# Altium schematic sheet MAZ000169 - Diagrama físico.SchDoc: MAZ000169 - Diagrama físico
size A; ApprovedBy: Christian Ledwidth; CheckedBy: Nahuel Martinez; Author: Santiago Marti; CompanyName: Body Health; DrawnBy: Santiago Marti; Revision: A; SheetNumber: 2; SheetTotal: 2
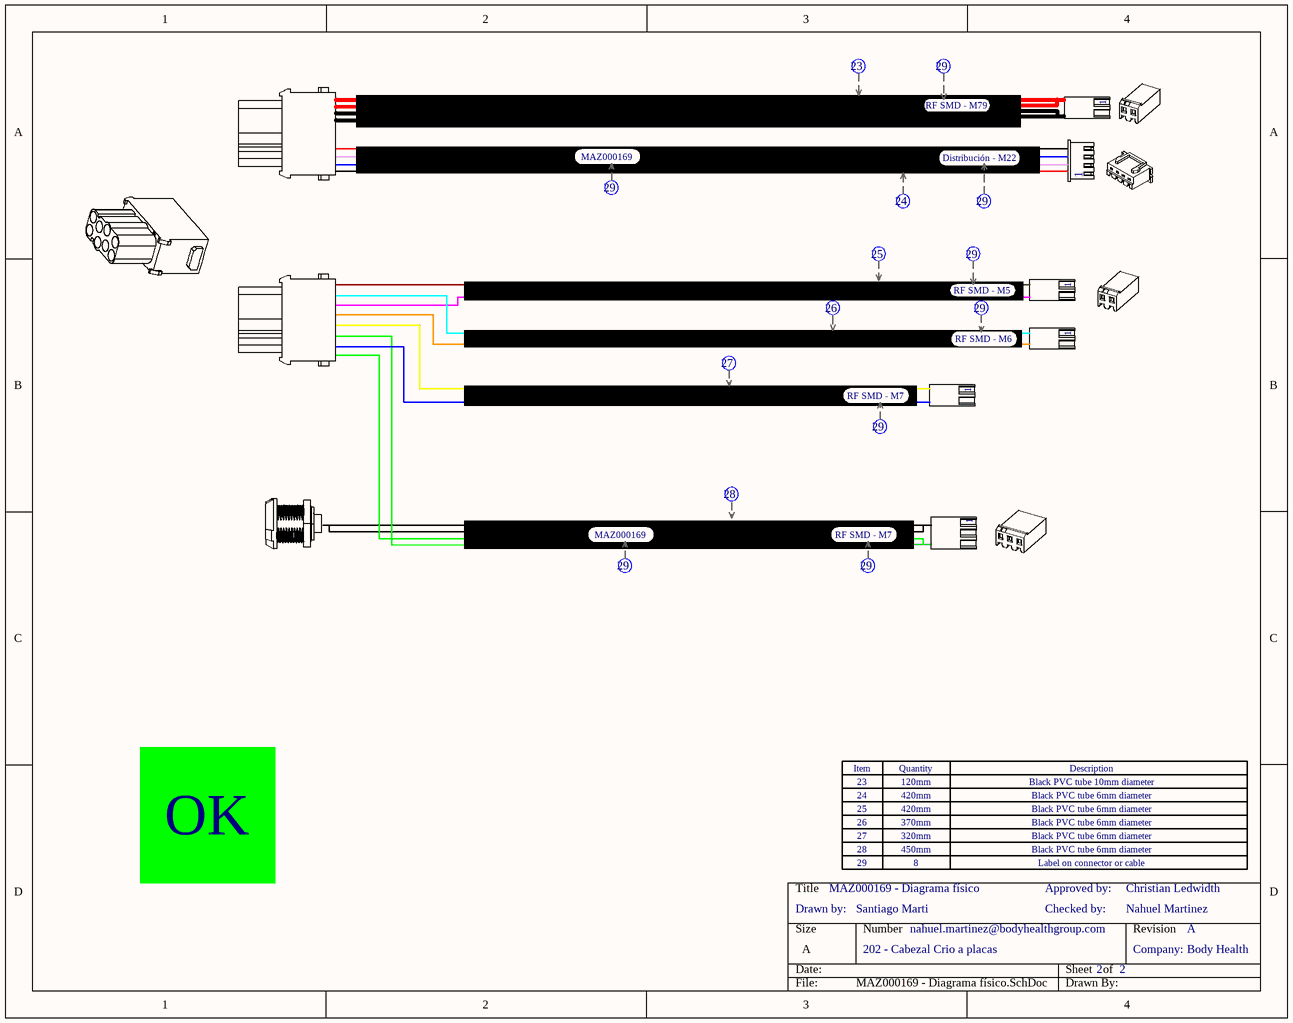
[diagram p0: MAZ000169 - Diagrama físico.SchDoc]

## Parts
(Parts that share a designator on the sheet are numbered #1, #2 ... from top to bottom, then left to right.)
Cab1  Cable  (value not drawn)
Cab2  Cable  (value not drawn)
Cab7  Cable  (value not drawn)
Cab8  Cable  (value not drawn)
Cab9  Cable  (value not drawn)
Cab10  Cable  (value not drawn)
Cab11  Cable  (value not drawn)
Cab12  Cable  (value not drawn)
Cab?#1  Cable  (value not drawn)
Cab?#2  Cable  (value not drawn)
Cab?#3  Cable  (value not drawn)
Cab?#4  Cable  (value not drawn)
Cab?#5  Cable  (value not drawn)
Cab?#6  Cable  (value not drawn)
Con1  XHP-4  (value not drawn)  (parts A,B of 4)
Con2  SL156-3  (value not drawn)  (parts A,B of 4)
Con3  09140083101  (value not drawn)  (part A of 4)
Con4  SL156-2  (value not drawn)  (parts A,B of 4)
Con5  SL156-2  (value not drawn)  (parts A,B of 4)
Con6  09140083101  (value not drawn)  (parts A,B of 4)
Con7  SL156-2  (value not drawn)  (part A of 4)
Con8  SL156-2  (value not drawn)  (part A of 4)
Conn?  SZCNT_02_Hembra  (value not drawn)  (part A of 3)
Zoc1  Zócalo_Header  (value not drawn)
Zoc12  Zócalo_Item  (value not drawn)
Zoc13  Zócalo_Item  (value not drawn)
Zoc14  Zócalo_Item  (value not drawn)
Zoc?#1  Zócalo_Item  (value not drawn)
Zoc?#2  Zócalo_Item  (value not drawn)
Zoc?#3  Zócalo_Item  (value not drawn)
Zoc?#4  Zócalo_Item  (value not drawn)

## Notes on the sheet
- (near Cab?#2) RF SMD - M79
- (near Cab?#3) MAZ000169
- Distribución - M22
- (near Cab10) RF SMD - M5
- RF SMD - M6
- (near Cab12) RF SMD - M7
- (near Cab?#5) MAZ000169
- (near Cab?#6) RF SMD - M7
- 23
- 120mm
- Black PVC tube 10mm diameter
- OK
- 24
- 25
- 26
- (near Zoc?#1) 27
- 420mm
- 370mm
- 320mm
- Black PVC tube 6mm diameter
- (near Zoc?#4) Drawn by:
- (near Zoc?#2) 28
- (near Zoc?#3) 29
- 450mm
- 8
- Checked by:
- Approved by:
- Label on connector or cable
- 202 - Cabezal Crio a placas
- nahuel.martinez@bodyhealthgroup.com
- Company:
- (in symbol Zócalo_Header) Item; Quantity; Description

## Library data of the parts
Cab1 = Cable: CallOut: 24; Largo: *mm; Sección: *mm2; Color: *
Cab2 Cab8 Cab10 Cab12 Cab?#2 Cab?#3 Cab?#5 Cab?#6 = Cable: CallOut: 29; Largo: *mm; Sección: *mm2; Color: *
Cab7 = Cable: CallOut: 25; Largo: *mm; Sección: *mm2; Color: *
Cab9 = Cable: CallOut: 26; Largo: *mm; Sección: *mm2; Color: *
Cab11 = Cable: CallOut: 27; Largo: *mm; Sección: *mm2; Color: *
Cab?#1 = Cable: CallOut: 23; Largo: *mm; Sección: *mm2; Color: *
Cab?#4 = Cable: CallOut: 28; Largo: *mm; Sección: *mm2; Color: *
Con1 = XHP-4: CONN HOUSING 2.5MM 4POS; Fabricante: JST Sales America Inc.; Cod.DigiKey: 455-2267-ND; Cod.Fabricante: XHP-4; ComponentLink1Description: Manufacturer Link; ComponentLink1URL: http://www.jst-mfg.com/product/pdf/eng/eXH.pdf; DIGIKEYx50: 0.06220; CallOut: *; DIGIKEYx100: NO
Con2 = SL156-3: CONN RECEPT 3 POS W/RAMP SL-156; Cod.Fabricante: 640250-3; Fabricante: TE Connectivity AMP Connectors; Cod.DigiKey: A19951-ND; ComponentLink1Description: Manufacturer Link; ComponentLink1URL: https://www.te.com/commerce/DocumentDelivery/DDEController?Action=srchrtrv&DocNm=640250&DocType=Customer+Drawing&DocLang=English; DIGIKEYx50: 0.14460; CallOut: *; DIGIKEYx100: 0.13430
Con3 Con6 = 09140083101: Han E Female 8 way; Fabricante: HARTING; Cod.DigiKey: 1195-1527-ND; Cod.Fabricante: 09140083101; ComponentLink1Description: Manufacturer Link; ComponentLink1URL: https://b2b.harting.com/files/download/PRD/PDF_TS/09140083101_100121409DRW009A.pdf; DIGIKEYx50: 7.60000; CallOut: *; DIGIKEYx100: 7.40000
Con4 Con5 Con7 Con8 = SL156-2: CONN RECEPT 2 POS W/RAMP SL-156; Cod.Fabricante: 640250-2; Fabricante: TE Connectivity AMP Connectors; Cod.DigiKey: A19950-ND; ComponentLink1Description: Manufacturer Link; ComponentLink1URL: https://www.te.com/commerce/DocumentDelivery/DDEController?Action=srchrtrv&DocNm=640250&DocType=Customer+Drawing&DocLang=English; DIGIKEYx50: 0.11420; CallOut: *; DIGIKEYx100: NO
Conn? = SZCNT_02_Hembra: Conector SZCNT 2 vías hembra para gabinete; Cod.DigiKey: Se compra a SZCNT; Cod.Fabricante: *; ComponentLink1Description: Manufacturer Link; ComponentLink1URL: *; DIGIKEYx100: *; Fabricante: SZCNT; CallOut: *; DIGIKEYx50: *
Zoc1 = Zócalo_Header: Header para el zócalo de referencias
Zoc12-Zoc14 Zoc?#1-Zoc?#4 = Zócalo_Item: Ítem para el zócalo de referencias; Desginator: *; Quantity: *; ItemDescription: *